# Altium schematic sheet ADDITION_SUBTRACTION.SchDoc
size A
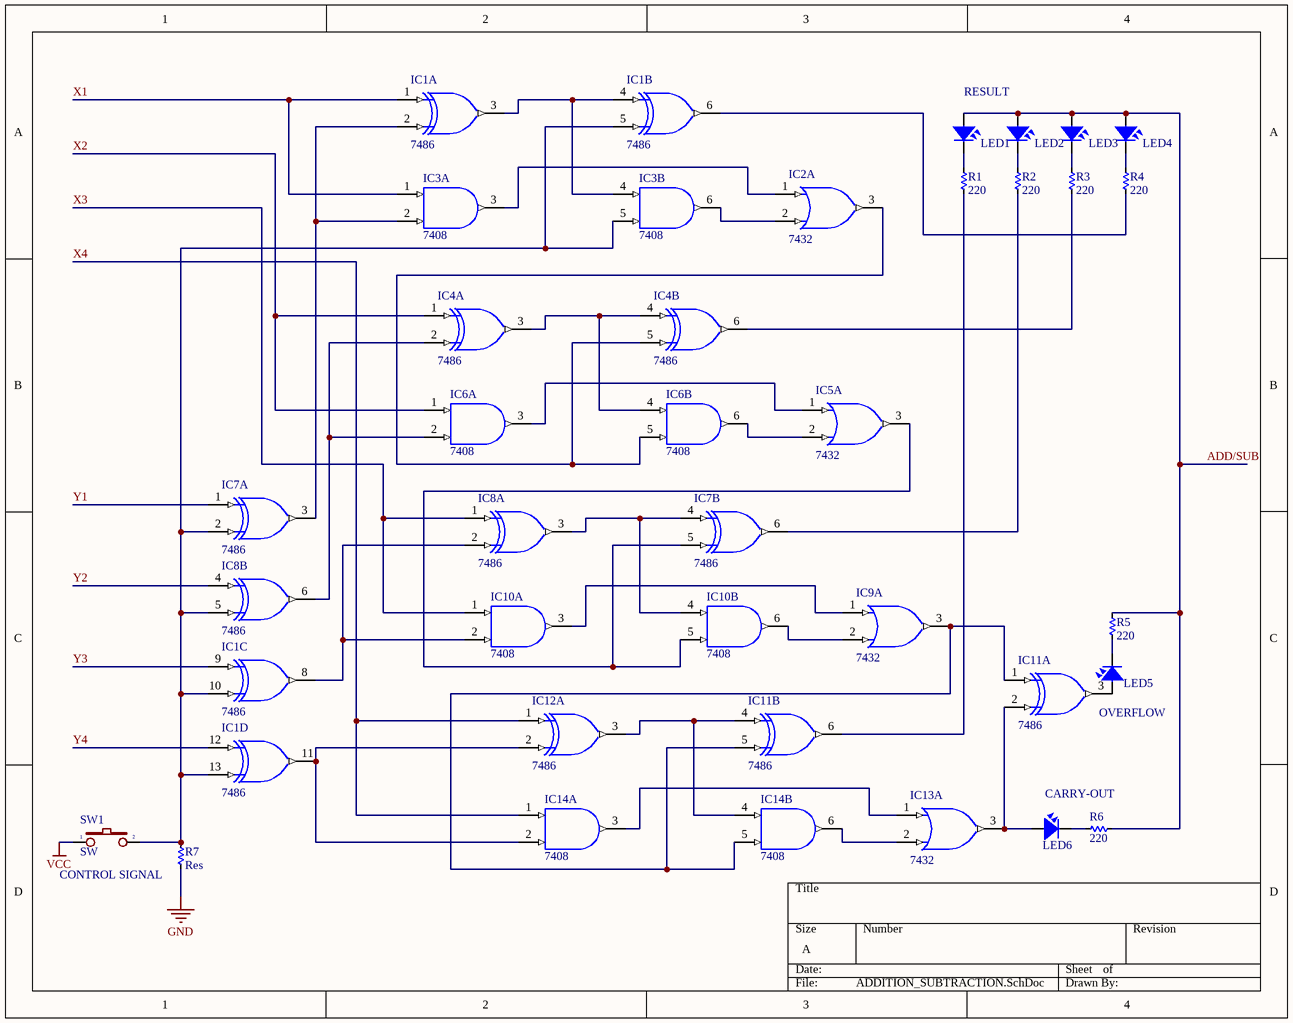
[diagram p0: ADDITION_SUBTRACTION.SchDoc]

## Parts
IC1  7486  [DIP14]  (parts A,B,C,D of 4)
IC2  7432  [DIP14]  (part A of 4)
IC3  7408  [DIP14]  (parts A,B of 4)
IC4  7486  [DIP14]  (parts A,B of 4)
IC5  7432  [DIP14]  (part A of 4)
IC6  7408  [DIP14]  (parts A,B of 4)
IC7  7486  [DIP14]  (parts A,B of 4)
IC8  7486  [DIP14]  (parts A,B of 4)
IC9  7432  [DIP14]  (part A of 4)
IC10  7408  [DIP14]  (parts A,B of 4)
IC11  7486  [DIP14]  (parts A,B of 4)
IC12  7486  [DIP14]  (part A of 4)
IC13  7432  [DIP14]  (part A of 4)
IC14  7408  [DIP14]  (parts A,B of 4)
LED1  LED  [LED-3MM-YELLOW]  (value not drawn)
LED2  LED  [LED-3MM-YELLOW]  (value not drawn)
LED3  LED  [LED-3MM-YELLOW]  (value not drawn)
LED4  LED  [LED-3MM-YELLOW]  (value not drawn)
LED5  LED  [LED-3MM-YELLOW]  (value not drawn)
LED6  LED  [LED-3MM-YELLOW]  (value not drawn)
R1  220  [RES-1/2W]
R2  220  [RES-1/2W]
R3  220  [RES-1/2W]
R4  220  [RES-1/2W]
R5  220  [RES-1/2W]
R6  220  [RES-1/2W]
R7  Res  [RES-1/2W]
SW1  SW  [SW1-SMD]

## Nets
GND: IC1.7(GND) IC2.7(GND) IC3.7(GND) IC4.7(GND) IC5.7(GND) IC6.7(GND) IC7.7(GND) IC8.7(GND) IC9.7(GND) IC10.7(GND) IC11.7(GND) IC12.7(GND) IC13.7(GND) IC14.7(GND) R7.2
VCC: IC2.14(VCC) IC3.14(VCC) IC5.14(VCC) IC6.14(VCC) IC9.14(VCC) IC10.14(VCC) IC13.14(VCC) IC14.14(VCC) SW1.1
VDD: IC1.14(VDD) IC4.14(VDD) IC7.14(VDD) IC8.14(VDD) IC11.14(VDD) IC12.14(VDD)
ADD/SUB: LED1.1 LED2.1 LED3.1 LED4.1 R5.1 R6.1
X1: IC1.1(A) IC3.1(A)
X2: IC4.1(A) IC6.1(A)
X3: IC8.1(A) IC10.1(A)
X4: IC12.1(A) IC14.1(A)
Y1: IC7.1(A)
Y2: IC8.4(A)
Y3: IC1.9(A)
Y4: IC1.12(A)
NetIC1_2: IC1.2(B) IC3.2(B) IC7.3(Y)
NetIC1_3: IC1.3(Y) IC1.4(A) IC3.4(A)
NetIC1_5: IC1.5(B) IC1.10(B) IC1.13(B) IC3.5(B) IC7.2(B) IC8.5(B) R7.1 SW1.2
NetIC1_6: IC1.6(Y) R4.1
NetIC1_8: IC1.8(Y) IC8.2(B) IC10.2(B)
NetIC1_11: IC1.11(Y) IC12.2(B) IC14.2(B)
NetIC2_1: IC2.1(A) IC3.3(O)
NetIC2_2: IC2.2(B) IC3.6(O)
NetIC2_3: IC2.3(Y) IC4.5(B) IC6.5(B)
NetIC4_2: IC4.2(B) IC6.2(B) IC8.6(Y)
NetIC4_3: IC4.3(Y) IC4.4(A) IC6.4(A)
NetIC4_6: IC4.6(Y) R3.1
NetIC5_1: IC5.1(A) IC6.3(O)
NetIC5_2: IC5.2(B) IC6.6(O)
NetIC5_3: IC5.3(Y) IC7.5(B) IC10.5(B)
NetIC7_4: IC7.4(A) IC8.3(Y) IC10.4(A)
NetIC7_6: IC7.6(Y) R2.1
NetIC9_1: IC9.1(A) IC10.3(O)
NetIC9_2: IC9.2(B) IC10.6(O)
NetIC9_3: IC9.3(Y) IC11.1(A) IC11.5(B) IC14.5(B)
NetIC11_2: IC11.2(B) IC13.3(Y) LED6.1
NetIC11_3: IC11.3(Y) LED5.1
NetIC11_4: IC11.4(A) IC12.3(Y) IC14.4(A)
NetIC11_6: IC11.6(Y) R1.1
NetIC13_1: IC13.1(A) IC14.3(O)
NetIC13_2: IC13.2(B) IC14.6(O)
NetLED1_2: LED1.2 R1.2
NetLED2_2: LED2.2 R2.2
NetLED3_2: LED3.2 R3.2
NetLED4_2: LED4.2 R4.2
NetLED5_2: LED5.2 R5.2
NetLED6_2: LED6.2 R6.2

## Notes on the sheet
- RESULT
- (near IC11) OVERFLOW
- CARRY-OUT
- CONTROL SIGNAL

## Library data of the parts
IC1 IC4 IC7 IC8 IC11 IC12 = 7486: Quad 2-Input XOR Gate; Value: 7486; Copyright by: VanDungEvn@Gmail.com
IC2 IC5 IC9 IC13 = 7432: Quad 2-Input OR Gate
IC3 IC6 IC10 IC14 = 7408: Quad 2-Input AND Gate; Value: 7408
LED1-LED6 = LED: LED Single colour Green and Red; Value: LED 3 ly Single Colour
R1-R7 = Res: Manufacturer: Generic Components; Class: Passive; SubClass: R; Published: 08/06/2000; Publisher: Altium Hobart Technology Centre
SW1 = SW2: Switch button 2 pin; Value: SW chip 2 pin